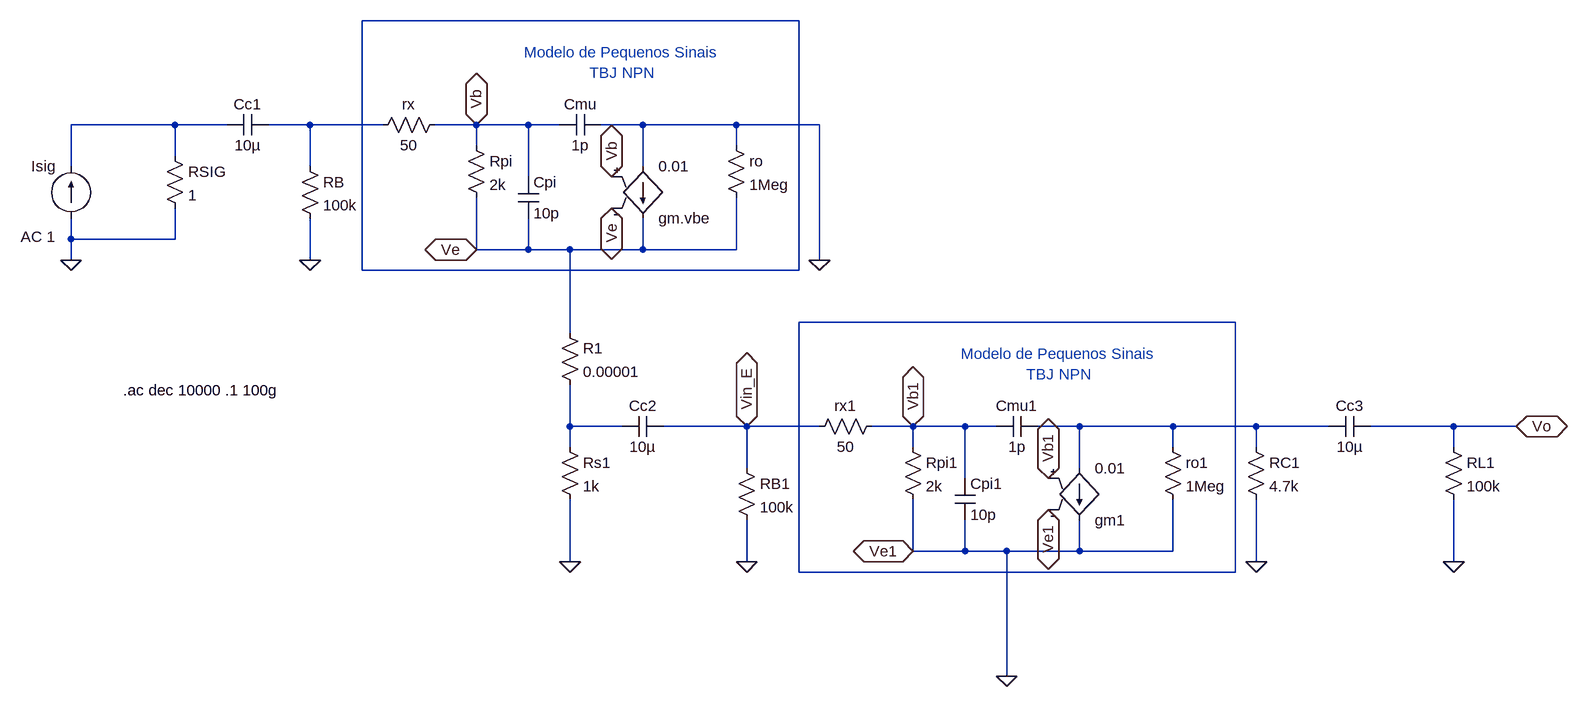
[diagram p0: schematic Cascata_Coletor_Comum_Emissor_Comum_Todas_Frequencias - Corrente.asc]
Cascata_Coletor_Comum_Emissor_Comum_Todas_Frequencias - Corrente.asc, the LTspice schematic file:
Version 4
SHEET 1 2232 948
WIRE 1040 -80 368 -80
WIRE 80 80 -80 80
WIRE 160 80 80 80
WIRE 288 80 224 80
WIRE 400 80 288 80
WIRE 544 80 480 80
WIRE 624 80 544 80
WIRE 672 80 624 80
WIRE 800 80 736 80
WIRE 944 80 800 80
WIRE 1072 80 944 80
WIRE 544 112 544 80
WIRE 944 112 944 80
WIRE 80 128 80 80
WIRE -80 144 -80 80
WIRE 288 144 288 80
WIRE 800 144 800 80
WIRE 624 160 624 80
WIRE -80 256 -80 224
WIRE 80 256 80 208
WIRE 80 256 -80 256
WIRE 544 272 544 192
WIRE 624 272 624 224
WIRE 624 272 544 272
WIRE 688 272 624 272
WIRE 800 272 800 224
WIRE 800 272 688 272
WIRE 944 272 944 192
WIRE 944 272 800 272
WIRE -80 288 -80 256
WIRE 288 288 288 224
WIRE 1072 288 1072 80
WIRE 368 304 368 -80
WIRE 1040 304 1040 -80
WIRE 1040 304 368 304
WIRE 1712 384 1040 384
WIRE 688 400 688 272
WIRE 688 544 688 480
WIRE 768 544 688 544
WIRE 960 544 832 544
WIRE 1072 544 960 544
WIRE 1216 544 1152 544
WIRE 1296 544 1216 544
WIRE 1344 544 1296 544
WIRE 1472 544 1408 544
WIRE 1616 544 1472 544
WIRE 1744 544 1616 544
WIRE 1856 544 1744 544
WIRE 2048 544 1920 544
WIRE 2144 544 2048 544
WIRE 688 576 688 544
WIRE 1216 576 1216 544
WIRE 1616 576 1616 544
WIRE 1744 576 1744 544
WIRE 2048 576 2048 544
WIRE 960 608 960 544
WIRE 1472 608 1472 544
WIRE 1296 624 1296 544
WIRE 1216 736 1216 656
WIRE 1296 736 1296 688
WIRE 1296 736 1216 736
WIRE 1360 736 1296 736
WIRE 1472 736 1472 688
WIRE 1472 736 1360 736
WIRE 1616 736 1616 656
WIRE 1616 736 1472 736
WIRE 688 752 688 656
WIRE 960 752 960 688
WIRE 1744 752 1744 656
WIRE 2048 752 2048 656
WIRE 1040 768 1040 384
WIRE 1712 768 1712 384
WIRE 1712 768 1040 768
WIRE 1360 928 1360 736
FLAG -80 288 0
FLAG 288 288 0
FLAG 752 160 Vb
IOPIN 752 160 BiDir
FLAG 752 208 Ve
IOPIN 752 208 BiDir
FLAG 544 80 Vb
IOPIN 544 80 BiDir
FLAG 544 272 Ve
IOPIN 544 272 BiDir
FLAG 1072 288 0
FLAG 688 752 0
FLAG 960 752 0
FLAG 1360 928 0
FLAG 1424 624 Vb1
IOPIN 1424 624 BiDir
FLAG 1424 672 Ve1
IOPIN 1424 672 BiDir
FLAG 1216 544 Vb1
IOPIN 1216 544 BiDir
FLAG 1216 736 Ve1
IOPIN 1216 736 BiDir
FLAG 1744 752 0
FLAG 2048 752 0
FLAG 2144 544 Vo
IOPIN 2144 544 BiDir
FLAG 960 544 Vin_E
IOPIN 960 544 BiDir
SYMBOL res 64 112 R0
SYMATTR InstName RSIG
SYMATTR Value 1
SYMBOL cap 224 64 R90
WINDOW 0 0 32 VBottom 2
WINDOW 3 32 32 VTop 2
SYMATTR InstName Cc1
SYMATTR Value 10µ
SYMBOL res 272 128 R0
SYMATTR InstName RB
SYMATTR Value 100k
SYMBOL res 928 96 R0
SYMATTR InstName ro
SYMATTR Value 1Meg
SYMBOL res 528 96 R0
SYMATTR InstName Rpi
SYMATTR Value 2k
SYMBOL g2 800 240 M180
SYMATTR InstName gm.vbe
SYMATTR Value 0.01
SYMBOL cap 736 64 R90
WINDOW 0 0 32 VBottom 2
WINDOW 3 32 32 VTop 2
SYMATTR InstName Cmu
SYMATTR Value 1p
SYMBOL cap 608 160 R0
SYMATTR InstName Cpi
SYMATTR Value 10p
SYMBOL res 496 64 R90
WINDOW 0 0 56 VBottom 2
WINDOW 3 32 56 VTop 2
SYMATTR InstName rx
SYMATTR Value 50
SYMBOL res 672 560 R0
SYMATTR InstName Rs1
SYMATTR Value 1k
SYMBOL cap 832 528 R90
WINDOW 0 0 32 VBottom 2
WINDOW 3 32 32 VTop 2
SYMATTR InstName Cc2
SYMATTR Value 10µ
SYMBOL res 944 592 R0
SYMATTR InstName RB1
SYMATTR Value 100k
SYMBOL res 1728 560 R0
SYMATTR InstName RC1
SYMATTR Value 4.7k
SYMBOL res 2032 560 R0
SYMATTR InstName RL1
SYMATTR Value 100k
SYMBOL res 1600 560 R0
SYMATTR InstName ro1
SYMATTR Value 1Meg
SYMBOL cap 1920 528 R90
WINDOW 0 0 32 VBottom 2
WINDOW 3 32 32 VTop 2
SYMATTR InstName Cc3
SYMATTR Value 10µ
SYMBOL res 1200 560 R0
SYMATTR InstName Rpi1
SYMATTR Value 2k
SYMBOL g2 1472 704 M180
SYMATTR InstName gm1
SYMATTR Value 0.01
SYMBOL cap 1408 528 R90
WINDOW 0 0 32 VBottom 2
WINDOW 3 32 32 VTop 2
SYMATTR InstName Cmu1
SYMATTR Value 1p
SYMBOL cap 1280 624 R0
SYMATTR InstName Cpi1
SYMATTR Value 10p
SYMBOL res 1168 528 R90
WINDOW 0 0 56 VBottom 2
WINDOW 3 32 56 VTop 2
SYMATTR InstName rx1
SYMATTR Value 50
SYMBOL current -80 224 R180
WINDOW 0 24 80 Left 2
WINDOW 3 24 0 Invisible 2
WINDOW 123 24 -28 Left 2
WINDOW 39 0 0 Left 0
SYMATTR InstName Isig
SYMATTR Value ""
SYMATTR Value2 AC 1
SYMBOL res 672 384 R0
SYMATTR InstName R1
SYMATTR Value 0.00001
TEXT 768 -16 Center 2 ;Modelo de Pequenos Sinais\nTBJ NPN
TEXT 0 488 Left 2 !.ac dec 10000 .1 100g
TEXT 1440 448 Center 2 ;Modelo de Pequenos Sinais\nTBJ NPN

The netlist it stands for:
* Cascata_Coletor_Comum_Emissor_Comum_Todas_Frequencias - Corrente.asc
RSIG N002 0 1
Cc1 N003 N002 10µ
RB N003 0 100k
ro 0 Ve 1Meg
Rpi Vb Ve 2k
gm.vbe 0 Ve Vb Ve 0.01
Cmu 0 Vb 1p
Cpi Vb Ve 10p
rx Vb N003 50
Rs1 N005 0 1k
Cc2 Vin_E N005 10µ
RB1 Vin_E 0 100k
RC1 N006 0 4.7k
RL1 Vo 0 100k
ro1 N006 0 1Meg
Cc3 Vo N006 10µ
Rpi1 Vb1 0 2k
gm1 N006 0 Vb1 0 0.01
Cmu1 N006 Vb1 1p
Cpi1 Vb1 0 10p
rx1 Vb1 Vin_E 50
Isig 0 N002 AC 1
R1 Ve N005 0.00001
* Modelo de Pequenos Sinais
* TBJ NPN
.ac dec 10000 .1 100g
* Modelo de Pequenos Sinais
* TBJ NPN
.backanno
.end